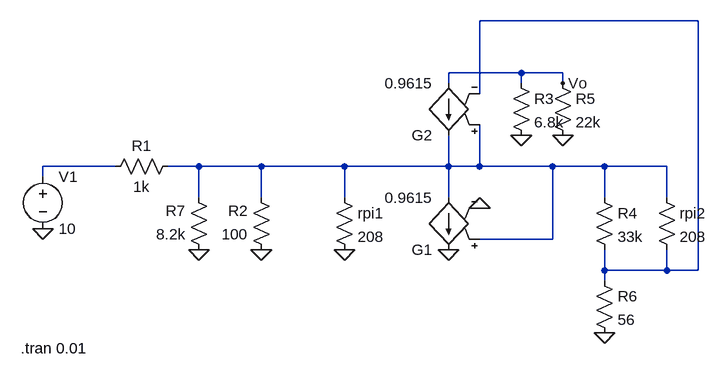
[diagram p0: schematic Draft1.asc]
Draft1.asc, the LTspice schematic file:
Version 4
SHEET 1 1000 680
WIRE 976 -64 640 -64
WIRE 704 16 592 16
WIRE 768 16 704 16
WIRE 592 32 592 16
WIRE 704 32 704 16
WIRE 768 32 768 16
WIRE 640 48 640 -64
WIRE 80 160 -32 160
WIRE 208 160 160 160
WIRE 304 160 208 160
WIRE 432 160 304 160
WIRE 592 160 592 112
WIRE 592 160 432 160
WIRE 640 160 640 96
WIRE 640 160 592 160
WIRE 752 160 640 160
WIRE 832 160 752 160
WIRE 928 160 832 160
WIRE -32 176 -32 160
WIRE 208 208 208 160
WIRE 304 208 304 160
WIRE 432 208 432 160
WIRE 592 208 592 160
WIRE 832 208 832 160
WIRE 928 208 928 160
WIRE 752 272 752 160
WIRE 752 272 640 272
WIRE 832 320 832 288
WIRE 928 320 928 288
WIRE 928 320 832 320
WIRE 976 320 976 -64
WIRE 976 320 928 320
WIRE 832 336 832 320
FLAG 768 112 0
FLAG 832 416 0
FLAG 592 288 0
FLAG 432 288 0
FLAG 304 288 0
FLAG -32 256 0
FLAG 768 32 Vo
FLAG 208 288 0
FLAG 704 112 0
FLAG 640 224 0
SYMBOL voltage -32 160 R0
WINDOW 123 0 0 Left 0
WINDOW 39 0 0 Left 0
SYMATTR InstName V1
SYMATTR Value 10
SYMBOL res 176 144 R90
WINDOW 0 0 56 VBottom 2
WINDOW 3 32 56 VTop 2
SYMATTR InstName R1
SYMATTR Value 1k
SYMBOL res 320 304 R180
WINDOW 0 36 76 Left 2
WINDOW 3 36 40 Left 2
SYMATTR InstName R2
SYMATTR Value 100
SYMBOL res 416 192 R0
SYMATTR InstName rpi1
SYMATTR Value 208
SYMBOL res 816 192 R0
SYMATTR InstName R4
SYMATTR Value 33k
SYMBOL res 816 320 R0
SYMATTR InstName R6
SYMATTR Value 56
SYMBOL res 752 16 R0
SYMATTR InstName R5
SYMATTR Value 22k
SYMBOL res 224 304 R180
WINDOW 0 36 76 Left 2
WINDOW 3 36 40 Left 2
SYMATTR InstName R7
SYMATTR Value 8.2k
SYMBOL res 912 192 R0
SYMATTR InstName rpi2
SYMATTR Value 208
SYMBOL res 688 16 R0
SYMATTR InstName R3
SYMATTR Value 6.8k
SYMBOL g 592 304 R180
SYMATTR InstName G1
SYMATTR Value 0.9615
SYMBOL g 592 128 R180
SYMATTR InstName G2
SYMATTR Value 0.9615
TEXT -66 440 Left 2 !.tran 0.01

The netlist it stands for:
* Draft1.asc
V1 N002 0 10
R1 N003 N002 1k
R2 0 N003 100
rpi1 N003 0 208
R4 N003 N001 33k
R6 N001 0 56
R5 Vo 0 22k
R7 0 N003 8.2k
rpi2 N003 N001 208
R3 Vo 0 6.8k
G1 N003 0 N003 0 0.9615
G2 Vo N003 N003 N001 0.9615
.tran 0.01
.backanno
.end